# Altium schematic sheet 04_POWER.SchDoc: WMI (POWER)
size A4
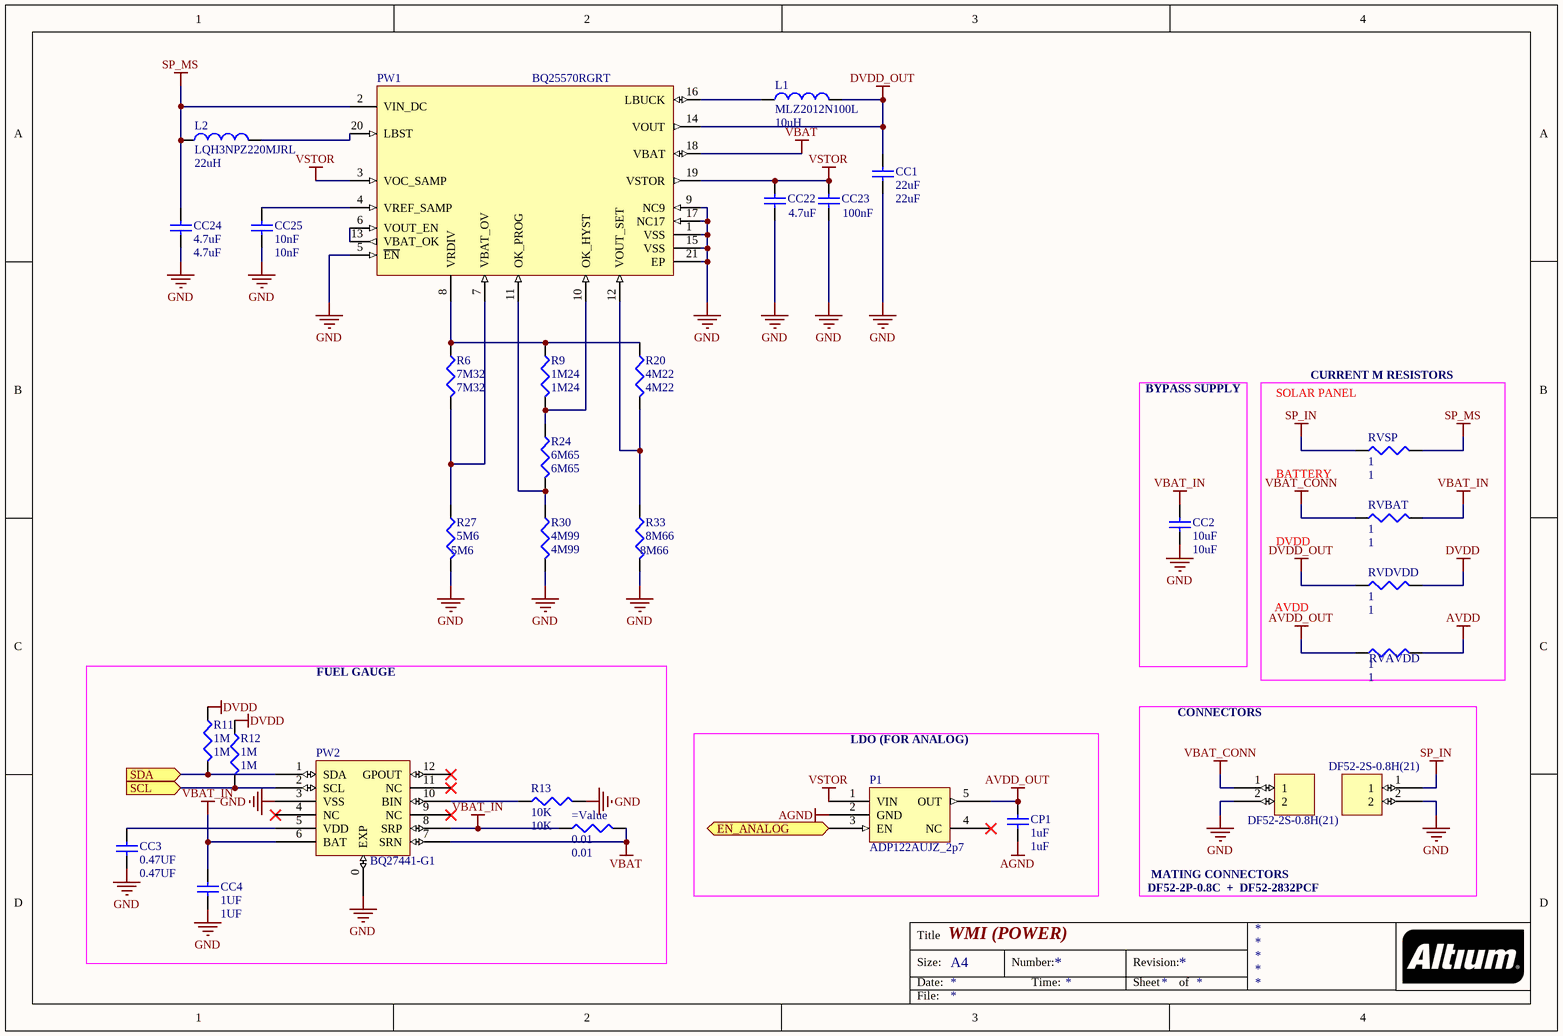
[diagram p0: 04_POWER.SchDoc]

## Parts
=Value  0.01  [0402]
CC1  22uF  [J1-0603]
CC2  10uF  [0402]
CC3  0.47UF  [0402]
CC4  1UF  [0402]
CC22  4.7uF  [0402]
CC23  100nF  [0603]
CC24  4.7uF  [0402]
CC25  10nF  [J1-0603]
CONN_BAT  DF52-2S-0.8H(21)  [DF52-2S-0.8H(21)]
CONN_P_S  DF52-2S-0.8H(21)  [DF52-2S-0.8H(21)]
CP1  1uF  [0402]
L1  MLZ2012N100L  value 10uH  [6-0805_N]
L2  LQH3NPZ220MJRL  value 22uH  [1212_PCK]
P1  ADP122AUJZ_2p7  [UJ-5_N]
PW1  BQ25570RGRT  [VQFN20]
PW2  BQ27441-G1  [DRZ12_SMALL]
R6  7M32  [0402]
R9  1M24  [0402]
R11  1M  [0402]
R12  1M  [0402]
R13  10K  [0402]
R20  4M22  [0402]
R24  6M65  [0402]
R27  5M6  [0402]
R30  4M99  [0402]
R33  8M66  [0402]
RVAVDD  1  [J1-0603]
RVBAT  1  [J1-0603]
RVDVDD  1  [J1-0603]
RVSP  1  [J1-0603]

## Blocks framed on the sheet
BYPASS SUPPLY: CC2
CURRENT M RESISTORS: RVAVDD RVBAT RVDVDD RVSP
FUEL GAUGE: =Value CC3 CC4 PW2 R11-R13
LDO (FOR ANALOG): CP1 P1

## Ports
EN_ANALOG (in), SCL (in), SDA (in)

## Nets
AGND: CP1.1 P1.2(GND)
AVDD: RVAVDD.2
AVDD_OUT: CP1.2 P1.5(OUT) RVAVDD.1
DVDD: R11.1 R12.1 RVDVDD.2
DVDD_OUT: CC1.2 L1.2 PW1.14(VOUT) RVDVDD.1
GND: CC1.1 CC2.1 CC3.1 CC4.1 CC22.1 CC23.1 CC24.1 CC25.1 CONN_BAT.2 CONN_P_S.2 PW1.1(VSS) PW1.5(~{EN}) PW1.9(NC9) PW1.15(VSS) PW1.17(NC17) PW1.21(EP) PW2.0(EXP) PW2.3(VSS) R13.2 R27.2 R30.2 R33.2
SP_IN: CONN_P_S.1 RVSP.1
SP_MS: CC24.2 L2.1 PW1.2(VIN_DC) RVSP.2
VBAT: =Value.2 PW1.18(VBAT) PW2.7(SRN)
VBAT_CONN: CONN_BAT.1 RVBAT.1
VBAT_IN: =Value.1 CC2.2 CC4.2 PW2.6(BAT) PW2.8(SRP) RVBAT.2
VSTOR: CC22.2 CC23.2 P1.1(VIN) PW1.3(VOC_SAMP) PW1.19(VSTOR)
EN_ANALOG: P1.3(EN) ; port EN_ANALOG
SCL: PW2.2(SCL) R12.2 ; port SCL
SDA: PW2.1(SDA) R11.2 ; port SDA
NetCC3_2: CC3.2 PW2.5(VDD)
NetCC25_2: CC25.2 PW1.4(VREF_SAMP)
NetL1_1: L1.1 PW1.16(LBUCK)
NetL2_2: L2.2 PW1.20(LBST)
NetPW1_6: PW1.6(VOUT_EN) PW1.13(VBAT_OK)
NetPW1_7: PW1.7(VBAT_OV) R6.2 R27.1
NetPW1_8: PW1.8(VRDIV) R6.1 R9.1 R20.1
NetPW1_10: PW1.10(OK_HYST) R9.2 R24.1
NetPW1_11: PW1.11(OK_PROG) R24.2 R30.1
NetPW1_12: PW1.12(VOUT_SET) R20.2 R33.1
NetPW2_10: PW2.10(BIN) R13.1

Not connected (* = marked no-connect by the designer): P1 4(NC)*; PW2 4(NC)* 9(NC)* 11(NC)* 12(GPOUT)*

## Notes on the sheet
- (near RVSP) SOLAR PANEL
- (near RVSP) BATTERY
- (near RVBAT) DVDD
- (near RVDVDD) AVDD
- CONNECTORS
- MATING CONNECTORS
- DF52-2P-0.8C  +  DF52-2832PCF
- Title
- Size:
- Date:
- A4
- Number:
- Time:
- Revision:
- Sheet
- of
- File:

## Library data of the parts
=Value R6 R9 R11-R13 R20 R24 R27 R30 R33 RVAVDD RVBAT RVDVDD RVSP = Res3: Resistor; Published: 8-Jun-2000; LatestRevisionDate: 29-May-2009; LatestRevisionNote: IPC-7351 Footprint Added.; PackageReference: J1-0603; Publisher: Altium Limited; PackageDescription: Chip Resistor
  =Value: Value: 0.01
  R6: Value: 7M32
  R9: Value: 1M24
  R11 R12: Value: 1M
  R13: Value: 10K
  R20: Value: 4M22
  R24: Value: 6M65
  R27: Value: 5M6
  R30: Value: 4M99
  R33: Value: 8M66
  RVAVDD RVBAT RVDVDD RVSP: Value: 1
CC1-CC4 CC22-CC25 CP1 = Cap Semi: Capacitor (Semiconductor SIM Model); Published: 8-Jun-2000; LatestRevisionDate: 29-May-2009; LatestRevisionNote: IPC-7351 Footprint Added.; PackageReference: C1206; Publisher: Altium Limited; PackageDescription: Chip Capacitor
  CC1: Value: 22uF
  CC2: Value: 10uF
  CC3: Value: 0.47UF
  CC4: Value: 1UF
  CC22 CC24: Value: 4.7uF
  CC23: Value: 100nF
  CC25: Value: 10nF
  CP1: Value: 1uF
L1 L2 = Inductor: Code_IEC: 1005; Published: 8-Jun-2000; LatestRevisionDate: 29-May-2009; LatestRevisionNote: IPC-7351 Footprint Added.; PackageReference: 0402-A; Publisher: Altium Limited; PackageDescription: Chip Inductor; Code_JEITA: 0402
P1 = ADP122: Regulator
PW1 = BQ25570RGRT: IC ENERGY HARV CTRLR BATT 20VQFN; Manufacturer: Texas Instruments; Current - Supply: 488nA; Voltage - Supply: 0.12 V ~ 4 V; Packaging: Tape & Reel (TR); Applications: Energy Harvesting; Operating Temperature: -40°C ~ 125°C; Mounting Type: Surface Mount; Package / Case: 20-VFQFN Exposed Pad; Supplier Device Package: 20-VQFN (3.5x3.5); P/N: BQ25570RGRT; Supplier: Digi-Key; Supplier Part Number: 296-37014-2-ND; ComponentLink1Description: bq25570.pdf; ComponentLink1URL: http://www.ti.com/lit/ds/symlink/bq25570.pdf